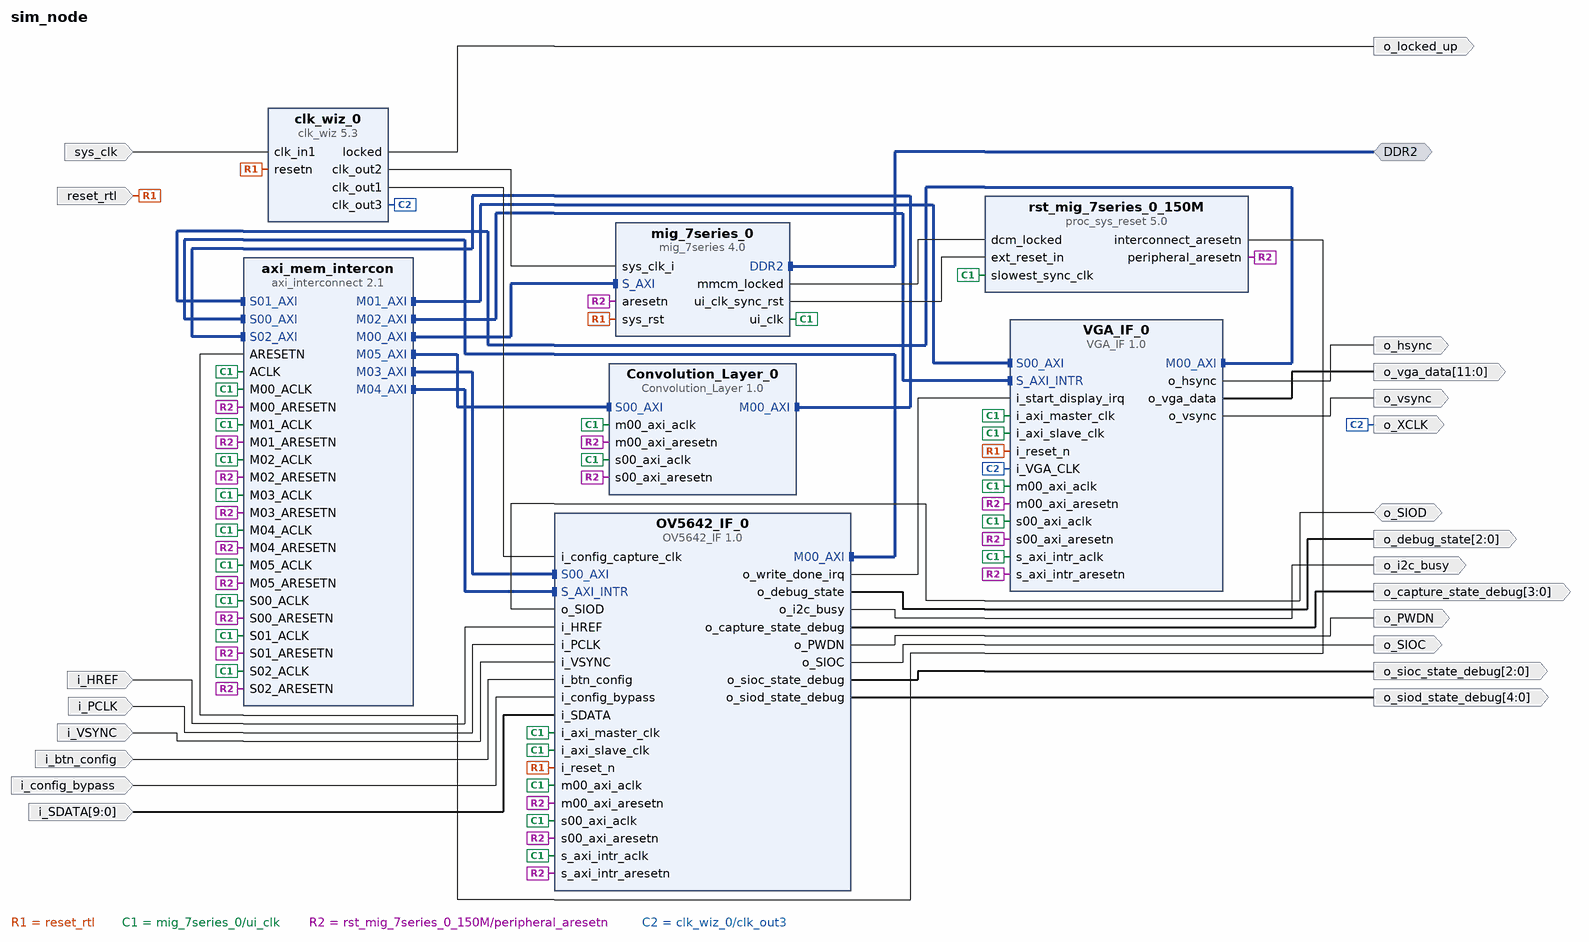
[diagram p0: block diagram of the top level]
# Vivado block design sim_node, xc7a100tcsg324-1, Vivado 2016.4
create_bd_design sim_node

create_bd_intf_port -mode Master -vlnv xilinx.com:interface:ddrx_rtl:1.0 DDR2
create_bd_port -dir I -type clk sys_clk
set_property -dict {CONFIG.FREQ_HZ 100000000} [get_bd_ports sys_clk]
create_bd_port -dir I -type rst reset_rtl
create_bd_port -dir O o_hsync
create_bd_port -dir O o_vsync
create_bd_port -dir O -from 11 -to 0 o_vga_data
create_bd_port -dir O -type clk o_XCLK
create_bd_port -dir O o_locked_up
create_bd_port -dir I i_HREF
create_bd_port -dir I i_PCLK
create_bd_port -dir I i_VSYNC
create_bd_port -dir I i_btn_config
create_bd_port -dir I i_config_bypass
create_bd_port -dir I -from 9 -to 0 i_SDATA
create_bd_port -dir O o_SIOC
create_bd_port -dir O o_PWDN
create_bd_port -dir O o_i2c_busy
create_bd_port -dir O -from 2 -to 0 o_debug_state
create_bd_port -dir O -from 2 -to 0 o_sioc_state_debug
create_bd_port -dir O -from 4 -to 0 o_siod_state_debug
create_bd_port -dir O -from 3 -to 0 o_capture_state_debug
create_bd_port -dir IO o_SIOD

create_bd_cell -type ip -vlnv xilinx.com:user:OV5642_IF:1.0 OV5642_IF_0
set_property -dict {CONFIG.C_M00_AXI_TARGET_SLAVE_BASE_ADDR 0x80000000} [get_bd_cells OV5642_IF_0]
create_bd_cell -type ip -vlnv xilinx.com:user:VGA_IF:1.0 VGA_IF_0
set_property -dict {CONFIG.C_M00_AXI_TARGET_SLAVE_BASE_ADDR 0x80000000} [get_bd_cells VGA_IF_0]
create_bd_cell -type ip -vlnv xilinx.com:user:Convolution_Layer:1.0 Convolution_Layer_0
create_bd_cell -type ip -vlnv xilinx.com:ip:axi_interconnect:2.1 axi_mem_intercon
set_property -dict {CONFIG.NUM_SI 3 CONFIG.NUM_MI 6} [get_bd_cells axi_mem_intercon]
create_bd_cell -type ip -vlnv xilinx.com:ip:clk_wiz:5.3 clk_wiz_0
set_property -dict [list \
  CONFIG.CLKOUT2_USED true \
  CONFIG.CLKOUT3_USED true \
  CONFIG.NUM_OUT_CLKS 3 \
  CONFIG.CLKOUT2_REQUESTED_OUT_FREQ 200 \
  CONFIG.CLKOUT3_REQUESTED_OUT_FREQ 25 \
  CONFIG.RESET_PORT resetn \
  CONFIG.MMCM_DIVCLK_DIVIDE 1 \
  CONFIG.MMCM_CLKOUT1_DIVIDE 5 \
  CONFIG.MMCM_CLKOUT2_DIVIDE 40 \
  CONFIG.RESET_TYPE ACTIVE_LOW \
  CONFIG.CLKOUT2_JITTER 114.829 \
  CONFIG.CLKOUT2_PHASE_ERROR 98.575 \
  CONFIG.CLKOUT3_JITTER 175.402 \
  CONFIG.CLKOUT3_PHASE_ERROR 98.575 \
] [get_bd_cells clk_wiz_0]
create_bd_cell -type ip -vlnv xilinx.com:ip:mig_7series:4.0 mig_7series_0
set_property -dict [list \
  CONFIG.XML_INPUT_FILE mig_a.prj \
  CONFIG.RESET_BOARD_INTERFACE Custom \
  CONFIG.BOARD_MIG_PARAM Custom \
] [get_bd_cells mig_7series_0]
create_bd_cell -type ip -vlnv xilinx.com:ip:proc_sys_reset:5.0 rst_mig_7series_0_150M

# ---- connections ----

connect_bd_intf_net [get_bd_intf_pins axi_mem_intercon/M00_AXI] [get_bd_intf_pins mig_7series_0/S_AXI]
connect_bd_intf_net [get_bd_intf_pins VGA_IF_0/M00_AXI] [get_bd_intf_pins axi_mem_intercon/S01_AXI]
connect_bd_intf_net [get_bd_intf_pins VGA_IF_0/S00_AXI] [get_bd_intf_pins axi_mem_intercon/M01_AXI]
connect_bd_intf_net [get_bd_intf_pins VGA_IF_0/S_AXI_INTR] [get_bd_intf_pins axi_mem_intercon/M02_AXI]
connect_bd_intf_net [get_bd_intf_pins OV5642_IF_0/M00_AXI] [get_bd_intf_pins axi_mem_intercon/S00_AXI]
connect_bd_intf_net [get_bd_intf_pins axi_mem_intercon/M03_AXI] [get_bd_intf_pins OV5642_IF_0/S00_AXI]
connect_bd_intf_net [get_bd_intf_pins axi_mem_intercon/M04_AXI] [get_bd_intf_pins OV5642_IF_0/S_AXI_INTR]
connect_bd_intf_net [get_bd_intf_pins axi_mem_intercon/M05_AXI] [get_bd_intf_pins Convolution_Layer_0/S00_AXI]
connect_bd_intf_net [get_bd_intf_pins Convolution_Layer_0/M00_AXI] [get_bd_intf_pins axi_mem_intercon/S02_AXI]
connect_bd_intf_net [get_bd_intf_ports DDR2] [get_bd_intf_pins mig_7series_0/DDR2]
connect_bd_net [get_bd_ports sys_clk] [get_bd_pins clk_wiz_0/clk_in1]
connect_bd_net [get_bd_ports reset_rtl] \
  [get_bd_pins OV5642_IF_0/i_reset_n] [get_bd_pins VGA_IF_0/i_reset_n] [get_bd_pins clk_wiz_0/resetn] \
  [get_bd_pins mig_7series_0/sys_rst]
connect_bd_net [get_bd_pins mig_7series_0/ui_clk] \
  [get_bd_pins OV5642_IF_0/i_axi_master_clk] [get_bd_pins OV5642_IF_0/i_axi_slave_clk] [get_bd_pins OV5642_IF_0/m00_axi_aclk] \
  [get_bd_pins OV5642_IF_0/s00_axi_aclk] [get_bd_pins OV5642_IF_0/s_axi_intr_aclk] [get_bd_pins VGA_IF_0/i_axi_master_clk] \
  [get_bd_pins VGA_IF_0/i_axi_slave_clk] [get_bd_pins VGA_IF_0/m00_axi_aclk] [get_bd_pins VGA_IF_0/s_axi_intr_aclk] \
  [get_bd_pins VGA_IF_0/s00_axi_aclk] [get_bd_pins Convolution_Layer_0/s00_axi_aclk] \
  [get_bd_pins Convolution_Layer_0/m00_axi_aclk] [get_bd_pins axi_mem_intercon/ACLK] [get_bd_pins axi_mem_intercon/S00_ACLK] \
  [get_bd_pins axi_mem_intercon/M00_ACLK] [get_bd_pins axi_mem_intercon/M01_ACLK] [get_bd_pins axi_mem_intercon/M02_ACLK] \
  [get_bd_pins axi_mem_intercon/M03_ACLK] [get_bd_pins axi_mem_intercon/M04_ACLK] [get_bd_pins axi_mem_intercon/S01_ACLK] \
  [get_bd_pins axi_mem_intercon/M05_ACLK] [get_bd_pins axi_mem_intercon/S02_ACLK] \
  [get_bd_pins rst_mig_7series_0_150M/slowest_sync_clk]
connect_bd_net [get_bd_pins mig_7series_0/mmcm_locked] [get_bd_pins rst_mig_7series_0_150M/dcm_locked]
connect_bd_net [get_bd_pins mig_7series_0/ui_clk_sync_rst] [get_bd_pins rst_mig_7series_0_150M/ext_reset_in]
connect_bd_net [get_bd_pins rst_mig_7series_0_150M/peripheral_aresetn] \
  [get_bd_pins OV5642_IF_0/m00_axi_aresetn] [get_bd_pins OV5642_IF_0/s00_axi_aresetn] \
  [get_bd_pins OV5642_IF_0/s_axi_intr_aresetn] [get_bd_pins VGA_IF_0/m00_axi_aresetn] \
  [get_bd_pins VGA_IF_0/s_axi_intr_aresetn] [get_bd_pins VGA_IF_0/s00_axi_aresetn] \
  [get_bd_pins Convolution_Layer_0/s00_axi_aresetn] [get_bd_pins Convolution_Layer_0/m00_axi_aresetn] \
  [get_bd_pins axi_mem_intercon/S00_ARESETN] [get_bd_pins axi_mem_intercon/M00_ARESETN] \
  [get_bd_pins axi_mem_intercon/M01_ARESETN] [get_bd_pins axi_mem_intercon/M02_ARESETN] \
  [get_bd_pins axi_mem_intercon/M03_ARESETN] [get_bd_pins axi_mem_intercon/M04_ARESETN] \
  [get_bd_pins axi_mem_intercon/S01_ARESETN] [get_bd_pins axi_mem_intercon/M05_ARESETN] \
  [get_bd_pins axi_mem_intercon/S02_ARESETN] [get_bd_pins mig_7series_0/aresetn]
connect_bd_net [get_bd_pins rst_mig_7series_0_150M/interconnect_aresetn] [get_bd_pins axi_mem_intercon/ARESETN]
connect_bd_net [get_bd_pins clk_wiz_0/clk_out2] [get_bd_pins mig_7series_0/sys_clk_i]
connect_bd_net [get_bd_pins VGA_IF_0/o_hsync] [get_bd_ports o_hsync]
connect_bd_net [get_bd_pins VGA_IF_0/o_vsync] [get_bd_ports o_vsync]
connect_bd_net [get_bd_pins VGA_IF_0/o_vga_data] [get_bd_ports o_vga_data]
connect_bd_net [get_bd_pins clk_wiz_0/clk_out3] [get_bd_ports o_XCLK] [get_bd_pins VGA_IF_0/i_VGA_CLK]
connect_bd_net [get_bd_pins clk_wiz_0/locked] [get_bd_ports o_locked_up]
connect_bd_net [get_bd_ports i_HREF] [get_bd_pins OV5642_IF_0/i_HREF]
connect_bd_net [get_bd_ports i_PCLK] [get_bd_pins OV5642_IF_0/i_PCLK]
connect_bd_net [get_bd_ports i_VSYNC] [get_bd_pins OV5642_IF_0/i_VSYNC]
connect_bd_net [get_bd_ports i_btn_config] [get_bd_pins OV5642_IF_0/i_btn_config]
connect_bd_net [get_bd_ports i_config_bypass] [get_bd_pins OV5642_IF_0/i_config_bypass]
connect_bd_net [get_bd_ports i_SDATA] [get_bd_pins OV5642_IF_0/i_SDATA]
connect_bd_net [get_bd_pins clk_wiz_0/clk_out1] [get_bd_pins OV5642_IF_0/i_config_capture_clk]
connect_bd_net [get_bd_pins OV5642_IF_0/o_SIOC] [get_bd_ports o_SIOC]
connect_bd_net [get_bd_pins OV5642_IF_0/o_PWDN] [get_bd_ports o_PWDN]
connect_bd_net [get_bd_pins OV5642_IF_0/o_write_done_irq] [get_bd_pins VGA_IF_0/i_start_display_irq]
connect_bd_net [get_bd_pins OV5642_IF_0/o_i2c_busy] [get_bd_ports o_i2c_busy]
connect_bd_net [get_bd_pins OV5642_IF_0/o_debug_state] [get_bd_ports o_debug_state]
connect_bd_net [get_bd_pins OV5642_IF_0/o_sioc_state_debug] [get_bd_ports o_sioc_state_debug]
connect_bd_net [get_bd_pins OV5642_IF_0/o_siod_state_debug] [get_bd_ports o_siod_state_debug]
connect_bd_net [get_bd_pins OV5642_IF_0/o_capture_state_debug] [get_bd_ports o_capture_state_debug]
connect_bd_net [get_bd_ports o_SIOD] [get_bd_pins OV5642_IF_0/o_SIOD]

# ---- address map ----
assign_bd_address -offset 0x44A00000 -range 64K -target_address_space [get_bd_addr_spaces Convolution_Layer_0/M00_AXI] [get_bd_addr_segs OV5642_IF_0/S00_AXI/S00_AXI_reg]
assign_bd_address -offset 0x44A10000 -range 64K -target_address_space [get_bd_addr_spaces Convolution_Layer_0/M00_AXI] [get_bd_addr_segs OV5642_IF_0/S_AXI_INTR/S_AXI_INTR_reg]
assign_bd_address -offset 0x44A20000 -range 64K -target_address_space [get_bd_addr_spaces Convolution_Layer_0/M00_AXI] [get_bd_addr_segs VGA_IF_0/S00_AXI/S00_AXI_reg]
assign_bd_address -offset 0x44A30000 -range 64K -target_address_space [get_bd_addr_spaces Convolution_Layer_0/M00_AXI] [get_bd_addr_segs VGA_IF_0/S_AXI_INTR/S_AXI_INTR_reg]
assign_bd_address -offset 0x44A40000 -range 64K -target_address_space [get_bd_addr_spaces Convolution_Layer_0/M00_AXI] [get_bd_addr_segs Convolution_Layer_0/S00_AXI/S00_AXI_reg]
assign_bd_address -offset 0x80000000 -range 128M -target_address_space [get_bd_addr_spaces Convolution_Layer_0/M00_AXI] [get_bd_addr_segs mig_7series_0/memmap/memaddr]
assign_bd_address -offset 0x44A00000 -range 64K -target_address_space [get_bd_addr_spaces OV5642_IF_0/M00_AXI] [get_bd_addr_segs OV5642_IF_0/S00_AXI/S00_AXI_reg]
assign_bd_address -offset 0x44A10000 -range 64K -target_address_space [get_bd_addr_spaces OV5642_IF_0/M00_AXI] [get_bd_addr_segs OV5642_IF_0/S_AXI_INTR/S_AXI_INTR_reg]
assign_bd_address -offset 0x44A20000 -range 64K -target_address_space [get_bd_addr_spaces OV5642_IF_0/M00_AXI] [get_bd_addr_segs VGA_IF_0/S00_AXI/S00_AXI_reg]
assign_bd_address -offset 0x44A30000 -range 64K -target_address_space [get_bd_addr_spaces OV5642_IF_0/M00_AXI] [get_bd_addr_segs VGA_IF_0/S_AXI_INTR/S_AXI_INTR_reg]
assign_bd_address -offset 0x44A40000 -range 64K -target_address_space [get_bd_addr_spaces OV5642_IF_0/M00_AXI] [get_bd_addr_segs Convolution_Layer_0/S00_AXI/S00_AXI_reg]
assign_bd_address -offset 0x80000000 -range 128M -target_address_space [get_bd_addr_spaces OV5642_IF_0/M00_AXI] [get_bd_addr_segs mig_7series_0/memmap/memaddr]
assign_bd_address -offset 0x44A00000 -range 64K -target_address_space [get_bd_addr_spaces VGA_IF_0/M00_AXI] [get_bd_addr_segs OV5642_IF_0/S00_AXI/S00_AXI_reg]
assign_bd_address -offset 0x44A10000 -range 64K -target_address_space [get_bd_addr_spaces VGA_IF_0/M00_AXI] [get_bd_addr_segs OV5642_IF_0/S_AXI_INTR/S_AXI_INTR_reg]
assign_bd_address -offset 0x44A20000 -range 64K -target_address_space [get_bd_addr_spaces VGA_IF_0/M00_AXI] [get_bd_addr_segs VGA_IF_0/S00_AXI/S00_AXI_reg]
assign_bd_address -offset 0x44A30000 -range 64K -target_address_space [get_bd_addr_spaces VGA_IF_0/M00_AXI] [get_bd_addr_segs VGA_IF_0/S_AXI_INTR/S_AXI_INTR_reg]
assign_bd_address -offset 0x44A40000 -range 64K -target_address_space [get_bd_addr_spaces VGA_IF_0/M00_AXI] [get_bd_addr_segs Convolution_Layer_0/S00_AXI/S00_AXI_reg]
assign_bd_address -offset 0x80000000 -range 128M -target_address_space [get_bd_addr_spaces VGA_IF_0/M00_AXI] [get_bd_addr_segs mig_7series_0/memmap/memaddr]

validate_bd_design
save_bd_design
